# Altium schematic sheet Comunicacao.SchDoc
size A4; SheetNumber: 4; SheetTotal: 4
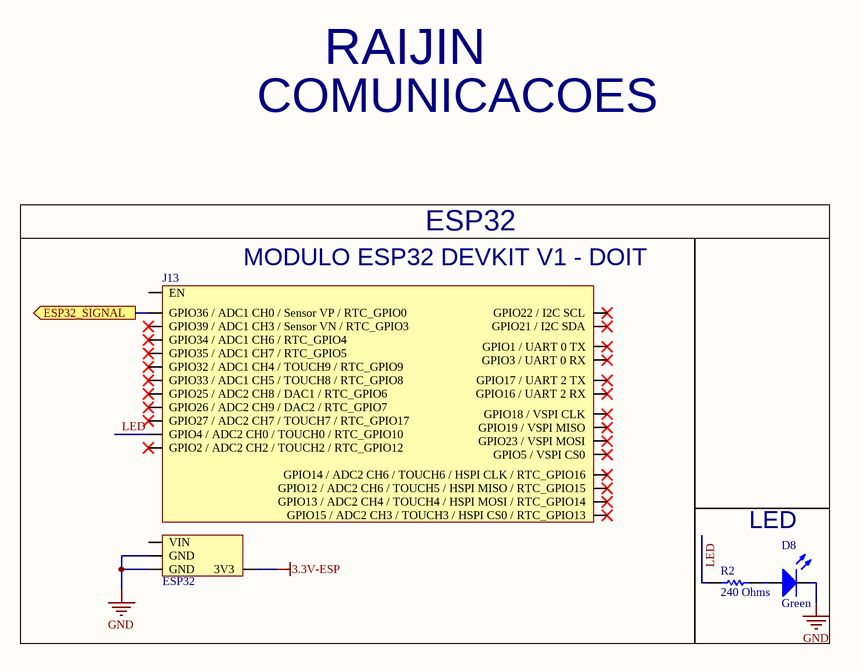
[diagram p0: Comunicacao.SchDoc]

## Parts
D8  Green  [LED_0603]
J13  ESP32  [Modulo ESP32]
R2  240 Ohms  [RESC1608X55N]

## Blocks framed on the sheet
ESP32: J13
LED: D8 R2

## Ports
ESP32_SIGNAL (out)

## Nets
3.3V-ESP: J13.3V3
GND: D8.C J13.GND
ESP32_SIGNAL: J13.PIN2(GPIO36_/_ADC1_CH0_/_Sensor_VP_/_RTC_GPIO0) ; port ESP32_SIGNAL
LED: J13.PIN26(GPIO4_/_ADC2_CH0_/_TOUCH0_/_RTC_GPIO10) R2.1
NetD8_A: D8.A R2.2

Not connected (* = marked no-connect by the designer): J13 EN PIN3(GPIO39_/_ADC1_CH3_/_Sensor_VN_/_RTC_GPIO3)* PIN4(GPIO34_/_ADC1_CH6_/_RTC_GPIO4)* PIN5(GPIO35_/_ADC1_CH7_/_RTC_GPIO5)* PIN6(GPIO32_/_ADC1_CH4_/_TOUCH9_/_RTC_GPIO9)* PIN7(GPIO33_/_ADC1_CH5_/_TOUCH8_/_RTC_GPIO8)* PIN8(GPIO25_/_ADC2_CH8_/_DAC1_/_RTC_GPIO6)* PIN9(GPIO26_/_ADC2_CH9_/_DAC2_/_RTC_GPIO7)* PIN10(GPIO27_/_ADC2_CH7_/_TOUCH7_/_RTC_GPIO17)* PIN11(GPIO14_/_ADC2_CH6_/_TOUCH6_/_HSPI_CLK_/_RTC_GPIO16)* PIN12(GPIO12_/_ADC2_CH6_/_TOUCH5_/_HSPI_MISO_/_RTC_GPIO15)* PIN13(GPIO13_/_ADC2_CH4_/_TOUCH4_/_HSPI_MOSI_/_RTC_GPIO14)* PIN16(GPIO23_/_VSPI_MOSI)* PIN17(GPIO22_/_I2C_SCL)* PIN18(GPIO1_/_UART_0_TX)* PIN19(GPIO3_/_UART_0_RX)* PIN20(GPIO21_/_I2C_SDA)* PIN21(GPIO19_/_VSPI_MISO)* PIN22(GPIO18_/_VSPI_CLK)* PIN23(GPIO5_/_VSPI_CS0)* PIN24(GPIO17_/_UART_2_TX)* PIN25(GPIO16_/_UART_2_RX)* PIN27(GPIO2_/_ADC2_CH2_/_TOUCH2_/_RTC_GPIO12)* PIN28(GPIO15_/_ADC2_CH3_/_TOUCH3_/_HSPI_CS0_/_RTC_GPIO13)* VIN

## Notes on the sheet
- RAIJIN
- COMUNICACOES
- (near J13) MODULO ESP32 DEVKIT V1 - DOIT

## Library data of the parts
D8 = 150060VS75000: LED 0.072W GREEN 40MCD 0603; Manufacturer: Wurth Elektronik; Current - Forward (If): 20 mA; Voltage - Forward (Vf): 2 V; Viewing Angle: 140°; Wavelength: 570nm; Max Power Dissipation: 72mW; Max Current Rating: 100mA; Reverse Voltage:: 5V; Library Control - Last Project that Used: Diodo/Led; Library Control - Person that Checked Footprint: Nícolas; Library Control - Person that did the Last Update Footprint: Marcos; Supplier 1: Mouser; Manufacturer Part Number: 150060VS75000; Category: Standard LEDs - SMD; Price: 1 = 0.15, 50 = 0.138, 100 = 0.118 (USD); Package / Case: 0603; Color: Green; Operating Temperature: -40~85 °C; Luminous Intensity: 40 mcd; Library Ref: LED; Supplier Part Number 1: 710-150060VS75000; Library Control - Checked Footprint: 25/07/2021; Library Control - Checked Schematic: 25/07/2021; Library Control - Last Update: 06/08/2021; Library Control - Person that Checked Schematic: Nícolas; Library Control - Person that did the Last Update Schematic: Marcos; ComponentLink1Description: Mouser Link; ComponentLink1URL: https://br.mouser.com/ProductDetail/Wurth-Elektronik/150060VS75000?qs=%2Fha2pyFaduhuT%2FKGSijZP0vTyJZ9U993KfsBQSxqATYhY9jnc2c09tXoMoJ3wn4L; ComponentLink2Description: Datasheet Link; ComponentLink2URL: https://br.mouser.com/datasheet/2/445/150060VS75000-1714627.pdf
J13 = Modulo ESP32: Header Modulo ESP32; Number of Contacts: 15; Library Control - Checked Footprint: Nikaum; Library Ref: Header; Library Control - Checked Schematic: Nikaum; Library Control - Last Project that Used: *; Library Control - Last Update: *; Library Control - Person that Checked Footprint: *; Library Control - Person that Checked Schematic: *; Library Control - Person that did the Last Update Schematic: Nikaum; Library Control - Persont that did the Last Update Footprint: Nikaum
R2 = RC0603FR-07240RL: RES SMD 240 OHM 1% 1/10W 0603; Manufacturer: YAGEO; Temperature Coefficient: 100 PPM / C; Power Rating: 1/10 W (100 mW); Supplier 1: Mouser; Part Number: RC0603FR-07240RL; Category: Current Sense Resistors - SMD; Price: 1= 0,10, 10= 0,024, 100= 0,01 (USD); Package / Case: 0603 (1608 metric); Operating Temperature: -55C ~ +155C; Value: 240 Ohms; Tolerance: 1%; Voltage Rating: -; Library Ref: Resistor; Resistor Type: Fixed; Size / Dimension: 1.6mm L x 0.8mm W x 0.45mm H; Supplier Part Number 1: 603-RC0603FR-07240RL; ComponentLink1Description: Mouser Link; ComponentLink1URL: https://br.mouser.com/ProductDetail/YAGEO/RC0603FR-07240RL?qs=%2Fha2pyFaduiUxY9aBc7vYsXmDGghjtsAaASQnplf3Fe6IIYOTbEeqCNZ6k5LKUyr; ComponentLink2Description: Datasheet; ComponentLink2URL: https://br.mouser.com/datasheet/2/447/Yageo_03_18_2021_PYu_RC_Group_51_RoHS_L_11-2199992.pdf